# EAGLE design led (EAGLE 8.3.1)
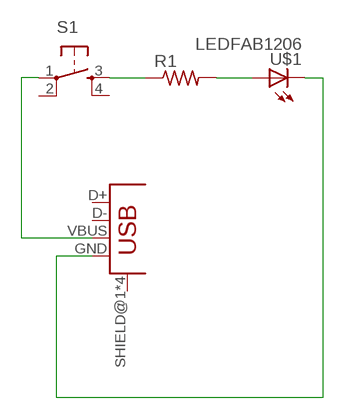
[diagram p0: schematic, sheet 1]

## Parts
R1  RES-US1206FAB  [R1206FAB]
S1  6MM_SWITCH6MM_SWITCH  [6MM_SWITCH]
U$1  LEDFAB1206  [LED1206FAB]
U$2  USB_MINIB  [USB_MINIB]

## Nets
N$1: S1.1(P) U$2.VBUS
N$2: R1.1 S1.3(S)
N$3: R1.2 U$1.1(A)
N$4: U$1.2(C) U$2.GND
Unconnected: S1.2(P1) S1.4(S1) U$2.D+ U$2.D- U$2.SHIELD@1(SHIELD) U$2.SHIELD@2(SHIELD) U$2.SHIELD@3(SHIELD) U$2.SHIELD@4(SHIELD)

## Library data of the parts
R1 = fab:RES-US: Resistor (US Symbol) Variants with postfix FAB are widened to allow the routing of internal traces
S1 = fab:6MM_SWITCH: OMRON SWITCH
U$1 = fab:LED: LED
U$2 = fab:USB_MINIB

## Board
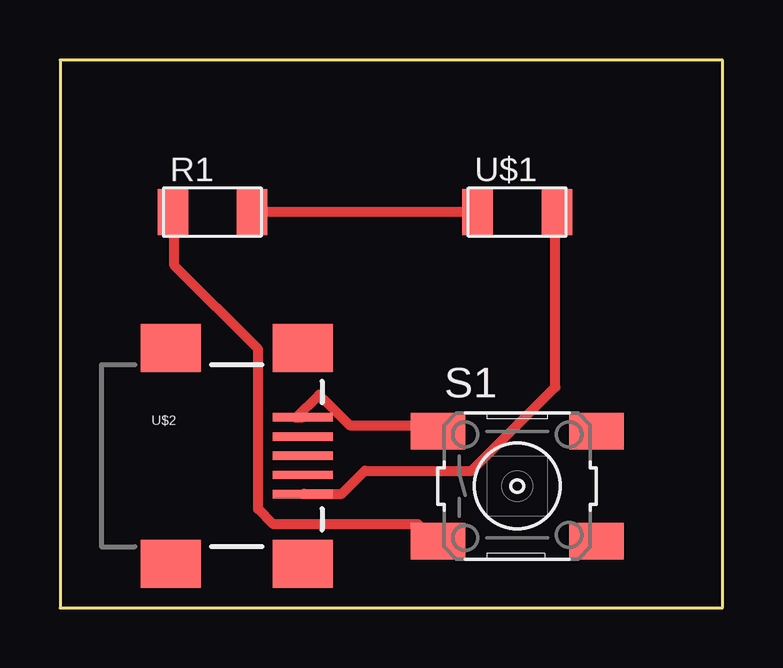
[diagram p1: board, top side]

Size 27.61 x 22.85 mm. Coordinates in mm from the lower left corner, seen from the top.
Outline: 0,0 27.61,0 27.61,22.85 0,22.85 0,0
Copper layers (1*16): Top 0.035mm / dielectric 1.5mm / Bottom 0.035mm
Design rules "default *": minimum track width 16mil, minimum drill 0.35mm, track to track 16mil, track to pad 16mil, pad to pad 16mil, via to via 16mil, smd to smd 16mil, copper to edge 40mil, drill to drill 6mil, minimum pad ring 10mil, minimum via ring 8mil, stop-mask expansion 4mil, vias tented up to drill 0mil, thermal gap 10mil

### Footprints (pad centres in the part's own frame; a part is rotated, then mirrored left to right if it is on the bottom)
R1206FAB = smd 1.27 x 1.905: 1 -1.651,0; 2 1.651,0
6MM_SWITCH = smd 2.286 x 1.524: 1 -3.302,2.286; 2 3.302,2.286; 3 -3.302,-2.286; 4 3.302,-2.286
LED1206FAB = smd 1.27 x 1.905: 1 -1.651,0; 2 1.651,0
USB_MINIB = smd 2.5 x 0.35: D+ 3.77,0; D- 3.77,0.8; GND 3.77,-1.6; ID 3.77,-0.8; VBUS 3.77,1.6 | smd 2.5 x 2: SHIELD@1 -1.73,-4.5; SHIELD@2 -1.73,4.5; SHIELD@3 3.77,4.5; SHIELD@4 3.77,-4.5

### Placement (x,y rotation side)
R1  6.35,16.51 0 top
S1  19.05,5.08 0 top
U$1  19.05,16.51 0 top
U$2  6.35,6.35 0 top

### Tracks (layer width: path | path; a pad name or v marks a point on that pad's centre or on a via)
N$1
  Top 0.406: S1.1 15.56,7.62 12.06,7.62 10.79,8.89 9.84,7.94 U$2.VBUS
N$2
  Top 0.406: R1.1 4.76,16.51 4.76,14.29 8.26,10.79 8.26,4.13 8.89,3.49 14.92,3.49 15.56,2.86 S1.3
N$3
  Top 0.406: U$1.1 R1.2
N$4
  Top 0.406: U$1.2 20.64,16.51 20.64,9.21 17.14,5.71 12.7,5.71 11.75,4.76 10.16,4.76 U$2.GND